# Altium schematic sheet MCU-TITLE.SchDoc: JS-Y1813-MCU-V10
size A3; Date: 2019.06.04; Revision: V1.0; SheetNumber: 1
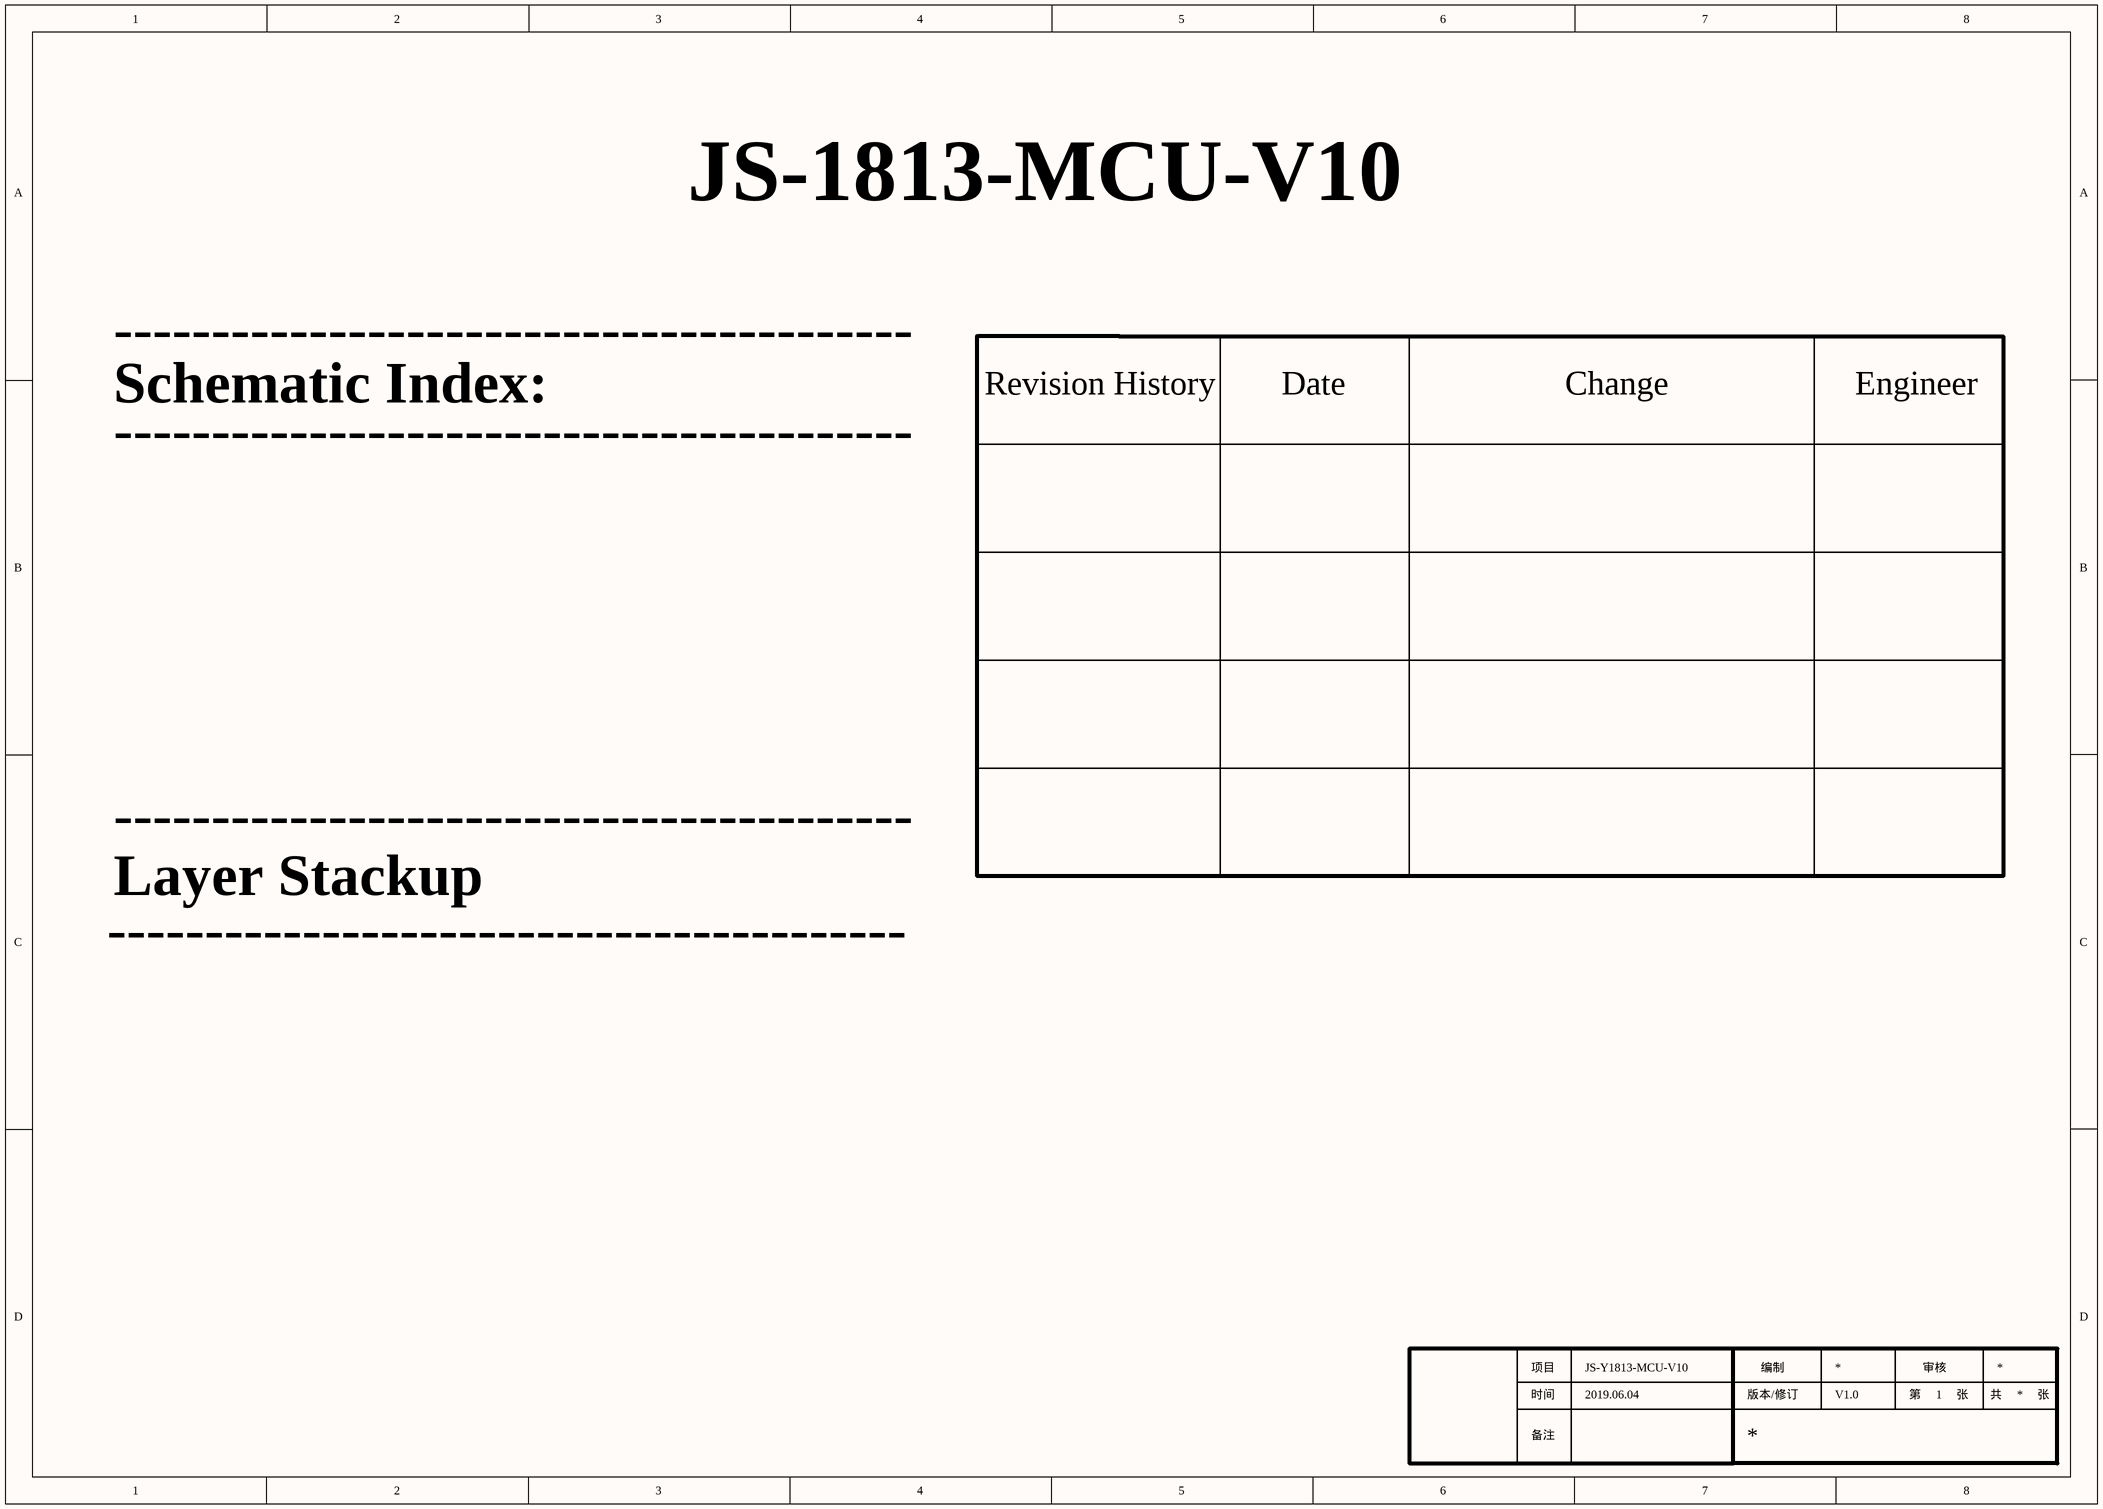
[diagram p0: MCU-TITLE.SchDoc]

## Notes on the sheet
- JS-1813-MCU-V10
- -----------------------------------------
- Schematic Index:
- Revision History
- Date
- Change
- Engineer
- Layer Stackup
- 项目
- 时间
- 版本/修订
- 编制
- 第
- 审核
- 张
- 共
- 备注